# Altium project MSXIV_RearPowerDistribution.PrjPcb (part 6 of 6)

## Sheet Power Distribution - Output to front Power Board.SchDoc: Output to Front Power Distribution
size B; Organization: Midnight Sun Solar Rayce Car Team; Address1: University of Waterloo; Address2: 200 University Ave W; Address3: Waterloo, ON, Canada; Address4: N2L 3E9; DocumentNumber: 13; SheetNumber: 13; SheetTotal: 13; Website: www.uwmidsun.com; ProjectName: ProjectName
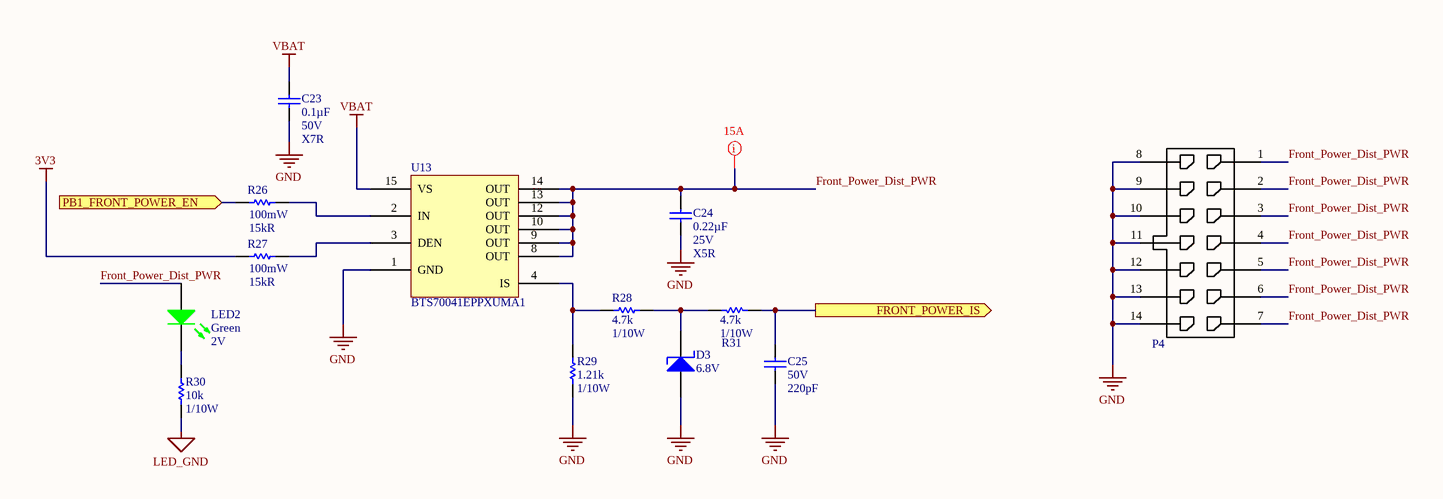
[diagram p12: Power Distribution - Output to front Power Board.SchDoc]

### Parts
C23  Capacitance: 0.1µF  Voltage: 50V  Temperature Coefficient: X7R  [CAP, 0603]  (hidden comment: CAP CER 0.1UF 50V 10% X7R 0603)
C24  Capacitance: 0.22µF  Voltage: 25V  Temperature Coefficient: X5R  [CAP, 0603]  (hidden comment: CAP CER 22uF 25V 20% X5R 0603)
C25  Voltage Rating: 50V  Capacitance: 220pF  [CAP, 0603]  (hidden comment: CAP CER 220PF 50V C0G/NP0 0603)
D3  6.8V  [DIODE SOD123]
LED2  Color: Green  Voltage - Forward (Vf) (Typ): 2V  [LED_0603]  (hidden comment: LED GREEN CLEAR 2V 0603)
P4  CONN 14POS MICRO-FIT 3mm  [CONN, 14POS MICRO-FIT 3mm]  (value not drawn)
R26  Power Rating: 100mW  Resistance: 15kR  [RES, 0603]  (hidden comment: RES SMD 15K OHM 1% 1/10W 0603)
R27  Power Rating: 100mW  Resistance: 15kR  [RES, 0603]  (hidden comment: RES SMD 15K OHM 1% 1/10W 0603)
R28  Resistance (Ohms): 4.7k  Power (Watts): 1/10W  [RES, 0603]  (hidden comment: RES 4.7K OHM 1% 1/10W 0603)
R29  Resistance: 1.21k  Power: 1/10W  [RES, 0603]  (hidden comment: RES 1.21K OHM 1% 1/10W 0603)
R30  Resistance: 10k  Power: 1/10W  [RES, 0603]  (hidden comment: RES 10K OHM 1% 1/10W 0603)
R31  Resistance (Ohms): 4.7k  Power (Watts): 1/10W  [RES, 0603]  (hidden comment: RES 4.7K OHM 1% 1/10W 0603)
U13  Manufacturer Part Number: BTS70041EPPXUMA1  [IC LOAD SWITCH PG-TSDSO-14-22]  (hidden comment: IC LOAD SWITCH BTS70041EPPXUMA1CT-ND_1)

### Ports
FRONT_POWER_IS (out), PB1_FRONT_POWER_EN (in)

### Nets
3V3: R27.1
GND: C23.2 C24.2 C25.2 D3.2(A) P4.8 P4.9 P4.10 P4.11 P4.12 P4.13 P4.14 R29.2 U13.1(GND)
LED_GND: R30.2
VBAT: C23.1 U13.15(VS)
Front_Power_Dist_PWR: C24.1 LED2.1(A) P4.1 P4.2 P4.3 P4.4 P4.5 P4.6 P4.7 U13.8(OUT) U13.9(OUT) U13.10(OUT) U13.12(OUT) U13.13(OUT) U13.14(OUT)
FRONT_POWER_IS: C25.1 R31.1 ; port FRONT_POWER_IS
PB1_FRONT_POWER_EN: R26.1 ; port PB1_FRONT_POWER_EN
NetD3_1: D3.1(K) R28.2 R31.2
NetLED2_2: LED2.2(K) R30.1
NetR26_2: R26.2 U13.2(IN)
NetR27_2: R27.2 U13.3(DEN)
NetR28_1: R28.1 R29.1 U13.4(IS)

### Layout directives
mark named 15A: Front_Power_Dist_PWR

### Notes on the sheet
- PROJECT
- DOCUMENT
- DRAWN BY
- LAST MODIFIED
- PART NUMBER
- REVISION
- SHEET
- VARIANT
- OF
- Engineering 5 - 1002
  University of Waterloo
  (519) 888-4567 x32978
  hardware@uwmidsun.com

### Library data of the parts
C23 = CAP CER 0.1UF 50V 10% X7R 0603: 0.10µF ±10% 50V Ceramic Capacitor X7R 0603 (1608 Metric); Manufacturer 1: AVX Corporation; Manufacturer Part Number 1: 06035C104KAT2A; Supplier 1: Digi-Key; Supplier Part Number 1: 478-5052-1-ND; Packaging: Cut Tape (CT); Part Status: Active; Operating Temperature: -55°C ~ 125°C; Ratings: -; Mounting Type: Surface Mount, MLCC; Package / Case: 0603 (1608 Metric); Size / Dimension: 0.063" L x 0.032" W (1.60mm x 0.81mm); Height - Seated (Max): -; Thickness (Max): 0.035" (0.90mm); Lead Spacing: -; Lead Style: -; ComponentLink1URL: http://datasheets.avx.com/X7RDielectric.pdf; ComponentLink1Description: http://datasheets.avx.com/X7RDielectric.pdf; Tolerance: ±10%
C24 = CAP CER 22uF 25V 20% X5R 0603: 0.22µF ±20% 25V Ceramic Capacitor X5R 0603 (1608 Metric); Manufacturer 1: Wurth Electronics Inc.; Manufacturer Part Number 1: 885012106019; Supplier 1: Digi-Key; Supplier Part Number 1: 732-7916-1-ND; Packaging: Cut Tape (CT); Part Status: Active; Operating Temperature: -55°C ~ 85°C; Ratings: -; Mounting Type: Surface Mount, MLCC; Package / Case: 0603 (1608 Metric); Size / Dimension: 0.063" L x 0.031" W (1.60mm x 0.80mm); Height - Seated (Max): -; Thickness (Max): 0.037" (0.95mm); Lead Spacing: -; Lead Style: -; ComponentLink1URL: http://katalog.we-online.de/pbs/datasheet/885012106019.pdf; ComponentLink1Description: http://katalog.we-online.de/pbs/datasheet/885012106019.pdf; Tolerance: ±20%
C25 = CAP CER 220PF 50V C0G/NP0 0603: 220pF ±5% 50V Ceramic Capacitor C0G, NP0 0603 (1608 Metric); Manufacturer: KEMET; Manufacturer Part Number: C0603C221J5GACAUTO; Dissipation Factor: 0.1%; Supplier 1: Digi-Key; Supplier Part Number 1: 399-6868-1-ND; Stock 1: 35170; Pricing 1: 1=0.14000, 10=0.09700, 100=0.04550, 500=0.03188, 1000=0.02640 (USD); RoHS: Yes; Mount: Surface Mount; Case/Package: 0603; Case Code (Metric): 1608; Case Code (Imperial): 0603; Contact Plating: Tin; Dielectric Material: Ceramic; Min Operating Temperature: -55°C; Max Operating Temperature: 125°C; Tolerance: 5%; Packaging: Tape and Reel; Package Quantity: 1; Voltage Rating (DC): 50V; Termination: SMD/SMT; Length: 1.6mm; Height: 0.8mm; Width: 0.031inch; Thickness: 0.034inch; Depth: 0.8mm; Ratings: AEC-Q200; Radiation Hardening: No; REACH SVHC: No SVHC; Lead Free: Lead Free; ComponentLink1URL: https://datasheet.ciiva.com/18192/getdatasheetpartid-416741-18192869.pdf?src-supplier=Verical; ComponentLink1Description: https://datasheet.ciiva.com/18192/getdatasheetpartid-416741-18192869.pdf?src-supplier=Verical; ComponentLink2URL: https://datasheet.ciiva.com/22694/1633156-22694015.pdf?src-supplier=Element14; ComponentLink2Description: https://datasheet.ciiva.com/22694/1633156-22694015.pdf?src-supplier=Element14; Dielectric: C0G
D3 = DIODE ZENER 6.8V 500MW SOD123: Zener Diode 6.8V 500mW ±5% Surface Mount SOD-123; Manufacturer: Diodes Incorporated; Manufacturer Part Number: MMSZ5235B-7-F; Supplier 1: Digi-Key; RoHS: RoHS Compliant; Category: Discrete Semiconductor Products; Stock 1: 24231; Pricing 1: 1=0.35, 10=0.286, 100=0.1513, 500=0.09956, 1000=0.06769 (CAD); Packaging: Cut Tape (CT); Part Status: Active; Tolerance: ±5%; Operating Temperature: -65°C ~ 150°C; Mounting Type: Surface Mount; Package / Case: SOD-123; Supplier Device Package: SOD-123; Base Part Number: MMSZ5235B; ComponentLink1URL: https://www.diodes.com/assets/Datasheets/ds18010.pdf; ComponentLink1Description: https://www.diodes.com/assets/Datasheets/ds18010.pdf; Supplier Part Number 1: MMSZ5235B-FDICT-ND
LED2 = LED GREEN CLEAR 2V 0603: Green 572nm LED Indication - Discrete 2V 0603 (1608 Metric); Manufacturer: Wurth Electronics Inc.; Manufacturer Part Number: 150060VS75000; Lens Color: Colorless; Millicandela Rating: 40mcd; Lens Style/Size: Rectangle with Flat Top, 1.10mm x 0.70mm; Current - Test: 20mA; Viewing Angle: 140°; Wavelength - Dominant: 570nm; Supplier 1: Digi-Key; RoHS: RoHS Compliant; Category: Optoelectronics; Stock 1: 9408; Pricing 1: 1=0.21, 100=0.1617, 500=0.13964 (CAD); Packaging: Cut Tape (CT); Part Status: Active; Lens Transparency: Clear; Mounting Type: Surface Mount; Wavelength - Peak: 572nm; Features: -; Package / Case: 0603 (1608 Metric); Supplier Device Package: 0603; Size / Dimension: 1.60mm L x 0.80mm W; Height (Max): 0.80mm; ComponentLink1URL: http://katalog.we-online.de/led/datasheet/150060VS75000.pdf; ComponentLink1Description: http://katalog.we-online.de/led/datasheet/150060VS75000.pdf; Supplier Part Number 1: 732-4980-1-ND
P4 = CONN 14POS MICRO-FIT 3mm: Connector Header Through Hole 14 position 0.118" (3.00mm); Manufacturer: Molex, LLC; Manufacturer Part Number: 0430451427; Number of Positions: 14; Number of Positions Loaded: All; Style: Board to Cable/Wire; Shrouding: Shrouded - 4 Wall; Contact Length - Post: 0.125" (3.18mm); Material Flammability Rating: UL94 V-0; Supplier 1: Digi-Key; RoHS: RoHS Compliant; Category: Connectors, Interconnects; Stock 1: 829; Pricing 1: 1=4.57, 10=4.377, 25=4.0124, 50=3.8296, 100=3.6473, 250=3.1914, 936=2.82666, 1872=2.5531, 2808=2.46192 (CAD); Packaging: Tray; Part Status: Active; Connector Type: Header; Contact Type: Male Pin; Pitch - Mating: 0.118" (3.00mm); Number of Rows: 2; Row Spacing - Mating: 0.118" (3.00mm); Mounting Type: Through Hole; Termination: Solder; Fastening Type: Locking Ramp; Contact Length - Mating: -; Overall Contact Length: -; Insulation Height: 0.390" (9.91mm); Contact Shape: Square; Contact Finish - Mating: Tin; Contact Finish Thickness - Mating: 60.0µin (1.52µm); Contact Finish - Post: Tin; Contact Material: Brass; Insulation Material: Liquid Crystal Polymer (LCP), Glass Filled; Features: Board Guide; Operating Temperature: -; Ingress Protection: -; Insulation Color: Black; Current Rating: -; Voltage Rating: -; Mated Stacking Heights: -; Contact Finish Thickness - Post: -; Applications: General Purpose, Medical, Military, Telecommunications; ComponentLink1URL: https://www.molex.com/pdm_docs/sd/430451427_sd.pdf; ComponentLink1Description: https://www.molex.com/pdm_docs/sd/430451427_sd.pdf; Supplier Part Number 1: WM10707-ND
R26 R27 = RES SMD 15K OHM 1% 1/10W 0603: 15 kOhms ±1% 0.1W, 1/10W Chip Resistor 0603 (1608 Metric) Moisture Resistant Thick Film; Manufacturer: Yageo; Manufacturer Part Number: RC0603FR-0715KL; Temperature Coefficient: 100ppm/°C; Voltage Rating (DC): 50V; Supplier 1: Digi-Key; RoHS: Yes; Stock 1: 8520111; Pricing 1: 1 = 0.10000, 10 = 0.02400, 100 = 0.00970, 1000 = 0.00437, 2500 = 0.00379 (USD); Case/Package: 0603; Number of Pins: 2; Case Code (Metric): 1608; Case Code (Imperial): 0603; Min Operating Temperature: -55°C; Max Operating Temperature: 155°C; Tolerance: 1%; Packaging: Tape and Reel; Composition: Thick Film; Package Quantity: 1; Voltage Rating: 50V; Number of Terminations: 2; Termination: SMD/SMT; Military Standard: Not; Max Power Dissipation: 100mW; Features: Moisture Resistant; Length: 1.6mm; Height: 0.022inch; Width: 0.031inch; Depth: 0.8mm; REACH SVHC: Unknown; Lead Free: Lead Free; ComponentLink1URL: http://www.yageo.com/documents/recent/PYu-RC_Group_51_RoHS_L_10.pdf; ComponentLink1Description: http://www.yageo.com/documents/recent/PYu-RC_Group_51_RoHS_L_10.pdf; ComponentLink2URL: http://www.yageo.com/documents/recent/PYu-RC_Group_51_RoHS_L_9.pdf; ComponentLink2Description: http://www.yageo.com/documents/recent/PYu-RC_Group_51_RoHS_L_9.pdf; ComponentLink3URL: https://www.verical.com/server-webapp/html/getDatasheet?partID=327895; ComponentLink3Description: https://www.verical.com/server-webapp/html/getDatasheet?partID=327895; Supplier Part Number 1: 311-15.0KHRCT-ND
R28 R31 = RES 4.7K OHM 1% 1/10W 0603: 4.7k Ohm ±1% 0.1W, 1/10W Chip Resistor 0603 (1608 Metric) Moisture Resistant Thick Film; Manufacturer 1: Yageo; Manufacturer Part Number 1: RC0603FR-074K7L; Description 1: RES SMD 4.7K OHM 1% 1/10W 0603; Temperature Coefficient: ±100ppm/°C; Supplier 1: Digi-Key; Supplier Part Number 1: 311-4.70KHRCT-ND; RoHS: RoHS Compliant; Category: Resistors; Stock 1: 3487566; Pricing 1: 1=0.16, 10=0.022, 100=0.0089, 1000=0.00402, 2500=0.00349 (CAD); Packaging: Cut Tape (CT); Part Status: Active; Composition: Thick Film; Features: Moisture Resistant; Operating Temperature: -55°C ~ 155°C; Package / Case: 0603 (1608 Metric); Supplier Device Package: 0603; Size / Dimension: 0.063" L x 0.031" W (1.60mm x 0.80mm); Height - Seated (Max): 0.022" (0.55mm); Failure Rate: -; ComponentLink1URL: http://www.yageo.com/documents/recent/PYu-RC_Group_51_RoHS_L_7.pdf; ComponentLink1Description: http://www.yageo.com/documents/recent/PYu-RC_Group_51_RoHS_L_7.pdf; Tolerance: ±1%
R29 = RES 1.21K OHM 1% 1/10W 0603: 1.21k Ohm ±1% 0.1W, 1/10W Chip Resistor 0603 (1608 Metric) Moisture Resistant Thick Film; Manufacturer 1: Yageo; Manufacturer Part Number 1: RC0603FR-071K21L; Temperature Coefficient: ±100ppm/°C; Supplier 1: Digi-Key; Supplier Part Number 1: 311-1.21KHRCT-ND; Packaging: Cut Tape (CT); Part Status: Active; Composition: Thick Film; Operating Temperature: -55°C ~ 155°C; Package / Case: 0603 (1608 Metric); Supplier Device Package: 0603; Size / Dimension: 0.063" L x 0.031" W (1.60mm x 0.80mm); Height - Seated (Max): 0.022" (0.55mm); Failure Rate: -; ComponentLink1URL: http://www.yageo.com/documents/recent/PYu-RC_Group_51_RoHS_L_7.pdf; ComponentLink1Description: http://www.yageo.com/documents/recent/PYu-RC_Group_51_RoHS_L_7.pdf; Tolerance: ±1%
R30 = RES 10K OHM 1% 1/10W 0603: RES SMD 10K OHM 1% 1/10W 0603; Manufacturer 1: Yageo; Manufacturer Part Number 1: RC0603FR-0710KL; Temperature Coefficient: ±100ppm/°C; Supplier 1: Digi-Key; Supplier Part Number 1: 311-10.0KHRCT-ND; Packaging: Cut Tape (CT); Part Status: Active; Composition: Thick Film; Operating Temperature: -55°C ~ 155°C; Package / Case: 0603 (1608 Metric); Supplier Device Package: 0603; Size / Dimension: 0.063" L x 0.031" W (1.60mm x 0.80mm); Height - Seated (Max): 0.022" (0.55mm); Failure Rate: -; ComponentLink1URL: http://www.yageo.com/documents/recent/PYu-RC_Group_51_RoHS_L_7.pdf; ComponentLink1Description: http://www.yageo.com/documents/recent/PYu-RC_Group_51_RoHS_L_7.pdf; Tolerance: ±1%
U13 = IC LOAD SWITCH BTS70041EPPXUMA1CT-ND_1: Power Switch/Driver 1:1 N-Channel 15A PG-TSDSO-14-22; Manufacturer: Infineon; RoHS: YES; ComponentLink1Description: https://www.infineon.com/dgdl/Infineon-BTS7004-1EPP-DS-v01_00-EN.pdf?fileId=5546d4626102d35a016147550a725555; ComponentLink1URL: https://www.infineon.com/dgdl/Infineon-BTS7004-1EPP-DS-v01_00-EN.pdf?fileId=5546d4626102d35a016147550a725555; Supplier 1: Digi-Key; Supplier Part Number 1: BTS70041EPPXUMA1CT-ND

## Nets that join several sheets
3V3: Controller_Board_Interface (8 pins), Power Distribution - Power Path (R33.1 R34.1 R35.1), Power Distribution - External ADC (8 pins), Power Distribution - IO Expander (11 pins), Power Distribution - Motor Interface and BMS (R55.1 R74#1.1), Power Distribution - Rear lights (R67.2 R69.2 R85.2), Power Distribution - Solar Sense, Telemetry, Rear Camera, and Charger (R94.2 R103.2), Power Distribution - Spare Load Switch (R112.2 R121.2), Power Distribution - Output to front Power Board (R27.1)
GND: Power Distribution - Power Supply (5 pins), Controller_Board_Interface (21 pins), Power Distribution - DC-DC (14 pins), Power Distribution - Aux Battery (19 pins), Power Distribution - Temperature Sense (8 pins), Power Distribution - Power Path (19 pins), Power Distribution - External ADC (7 pins), Power Distribution - IO Expander (9 pins), Power Distribution - Motor Interface and BMS (18 pins), Power Distribution - Rear lights (33 pins), Power Distribution - Solar Sense, Telemetry, Rear Camera, and Charger (22 pins), Power Distribution - Spare Load Switch (22 pins), Power Distribution - Output to front Power Board (13 pins)
LDO_3V: Power Distribution - DC-DC (5 pins), Power Distribution - Aux Battery (9 pins), Power Distribution - Temperature Sense (C37#1.1 U15.8)
LED_GND: Power Distribution - Motor Interface and BMS (R57.2 R63.2), Power Distribution - Rear lights (6 pins), Power Distribution - Solar Sense, Telemetry, Rear Camera, and Charger (R100.2 R101.2 R109.2 R110.2), Power Distribution - Spare Load Switch (R118.2 R119.2 R127.2 R128.2), Power Distribution - Output to front Power Board (R30.2)
VBAT: Controller_Board_Interface (8 pins), Power Distribution - Power Path (38 pins), Power Distribution - Motor Interface and BMS (C42.1 C45.1 U16.15 U17.15), Power Distribution - Rear lights (6 pins), Power Distribution - Solar Sense, Telemetry, Rear Camera, and Charger (C60.1 C64.1 U21.15 U22.15), Power Distribution - Spare Load Switch (C68.1 C72.1 U23.15 U24.15), Power Distribution - Output to front Power Board (C23.1 U13.15)
AUX_FUSED: Power Distribution - Aux Battery (R5#2.2 TP6.1 U3.3), Power Distribution - Power Path (11 pins)
AUX_ISENSE: Power Distribution - Aux Battery (C7#2.1 R8#2.2), Power Distribution - External ADC (U7.7)
AUX_OVERCURRENT: Power Distribution - Aux Battery (U2.1), Power Distribution - Power Path (R40.2 R45.1)
AUX_TEMP: Power Distribution - Temperature Sense (C41.1 R53.2), Power Distribution - External ADC (U8.6)
AUX_THERMISTOR: Power Distribution - Aux Battery (P2.4), Power Distribution - Temperature Sense (C40.1 R54.1 U15.5)
AUX_VSENSE: Power Distribution - Aux Battery (C11.1 R12.2), Power Distribution - External ADC (U7.5)
BMS_CARRIER_EN: Power Distribution - IO Expander (U12.9), Power Distribution - Motor Interface and BMS (R88#1.1)
BMS_ISENSE: Power Distribution - External ADC (U9.5), Power Distribution - Motor Interface and BMS (C47.1 R65.1)
CAM_CHAGER_IS: Power Distribution - External ADC (U8.4), Power Distribution - Solar Sense, Telemetry, Rear Camera, and Charger (C65.1 R108.1)
CENTER_BRAKE_LIGHT_EN: Power Distribution - IO Expander (U12.8), Power Distribution - Rear lights (R67.4)
CHARGER_EN: Power Distribution - IO Expander (U12.10), Power Distribution - Solar Sense, Telemetry, Rear Camera, and Charger (R103.4)
DCDC_FUSED: Power Distribution - DC-DC (R15.2 TP7.1 U5.3), Power Distribution - Power Path (15 pins)
DCDC_ISENSE: Power Distribution - DC-DC (C14.1 R16.2), Power Distribution - External ADC (U7.6)
DCDC_TEMP: Power Distribution - Temperature Sense (C39.1 R51.2), Power Distribution - External ADC (U8.7)
DCDC_THERMISTOR: Power Distribution - DC-DC (P3.1), Power Distribution - Temperature Sense (C38#1.1 R52.1 U15.3)
DCDC_VSENSE: Power Distribution - DC-DC (C17.1 R18.2), Power Distribution - External ADC (U7.4)
FRONT_POWER_IS: Power Distribution - External ADC (U8.5), Power Distribution - Output to front Power Board (C25.1 R31.1)
IO_EX_I2C_SCL: Controller_Board_Interface (I2C_SCL.TP P1.14 R8#1.2), Power Distribution - IO Expander (U10.23 U12.23)
IO_EX_I2C_SDA: Controller_Board_Interface (I2C_SDA.TP P1.13 R9#1.2), Power Distribution - IO Expander (U10.22 U12.22)
MOTOR_INTERFACE_EN: Power Distribution - IO Expander (U12.17), Power Distribution - Motor Interface and BMS (R61.1)
MOTOR_INTERFACE_ISENSE: Power Distribution - External ADC (U9.14), Power Distribution - Motor Interface and BMS (C44.1 R59.1)
PA2_MUX_EN: Controller_Board_Interface (P1.23), Power Distribution - IO Expander (U11.15)
PA3_MUX_SEL4: Controller_Board_Interface (P1.22), Power Distribution - IO Expander (U11.13)
PA4_MUX_SEL3: Controller_Board_Interface (P1.21), Power Distribution - External ADC (U9.9), Power Distribution - IO Expander (U11.14)
PA5_MUX_SEL2: Controller_Board_Interface (P1.20), Power Distribution - External ADC (U9.10), Power Distribution - IO Expander (U11.11)
PA6_MUX_SEL1: Controller_Board_Interface (P1.19), Power Distribution - External ADC (U9.11), Power Distribution - IO Expander (U11.10)
PA7_MUX_OUTPUT: Controller_Board_Interface (P1.18), Power Distribution - IO Expander (U11.1)
PB13_IO_2_INT: Controller_Board_Interface (P1.10), Power Distribution - IO Expander (R79#1.2 U12.1)
PB14_IO_1_INT: Controller_Board_Interface (P1.9), Power Distribution - IO Expander (R78#1.2 U10.1)
POWER_SUPLLY_FUSED: Power Distribution - Power Supply (R130.2), Power Distribution - Power Path (15 pins)
REAR_BRAKE_LIGHT_DSEL: Power Distribution - IO Expander (U10.18), Power Distribution - Rear lights (R85.3)
REAR_BRK_LIGHT_ISENSE: Power Distribution - External ADC (U9.12), Power Distribution - Rear lights (C57.1 R90.1)
REAR_CAMERA_EN: Power Distribution - IO Expander (U10.5), Power Distribution - Solar Sense, Telemetry, Rear Camera, and Charger (R103.1)
REAR_LEFT_BRAKEL_EN: Power Distribution - IO Expander (U10.17), Power Distribution - Rear lights (R85.4)
REAR_LEFT_TURN_EN: Power Distribution - IO Expander (U10.11), Power Distribution - Rear lights (R69.4)
REAR_RIGHT_BRAKEL_EN: Power Distribution - IO Expander (U10.19), Power Distribution - Rear lights (R85.1)
REAR_RIGHT_TURN_EN: Power Distribution - IO Expander (U10.9), Power Distribution - Rear lights (R69.1)
REAR_TURN_LIGHT_DSEL: Power Distribution - IO Expander (U10.10), Power Distribution - Rear lights (R69.3)
REAR_TURN_LIGHT_ISENSE: Power Distribution - External ADC (U9.13), Power Distribution - Rear lights (C51.1 R78#2.1)
SOLAR_SENSE_EN: Power Distribution - IO Expander (U12.5), Power Distribution - Solar Sense, Telemetry, Rear Camera, and Charger (R94.1)
SOLAR_TELEMETRY_DSEL: Power Distribution - IO Expander (U12.4), Power Distribution - Solar Sense, Telemetry, Rear Camera, and Charger (R94.3)
SOLAR_TELEMETRY_ISENSE: Power Distribution - External ADC (U9.4), Power Distribution - Solar Sense, Telemetry, Rear Camera, and Charger (C61.1 R99.1)
SPARE1_2_ISENSE: Power Distribution - External ADC (U9.2), Power Distribution - Spare Load Switch (C69.1 R117.1)
SPARE3_4_ISENSE: Power Distribution - External ADC (U9.1), Power Distribution - Spare Load Switch (C73.1 R126.1)
SPARE_3_4_DESEL: Power Distribution - IO Expander (U10.7), Power Distribution - Spare Load Switch (R121.3)
STROBE_CTR_BRK_DSEL: Power Distribution - IO Expander (U12.7), Power Distribution - Rear lights (R67.3)
STROBE_CTR_BRK_ISENSE: Power Distribution - External ADC (U9.15), Power Distribution - Rear lights (C50.1 R76.1)
STROBE_LIGHT_EN: Power Distribution - IO Expander (U12.6), Power Distribution - Rear lights (R67.1)
TELEMETRY_EN: Power Distribution - IO Expander (U12.18), Power Distribution - Solar Sense, Telemetry, Rear Camera, and Charger (R94.4)